# Altium schematic sheet VDB Linear Regulators.SchDoc
size A3
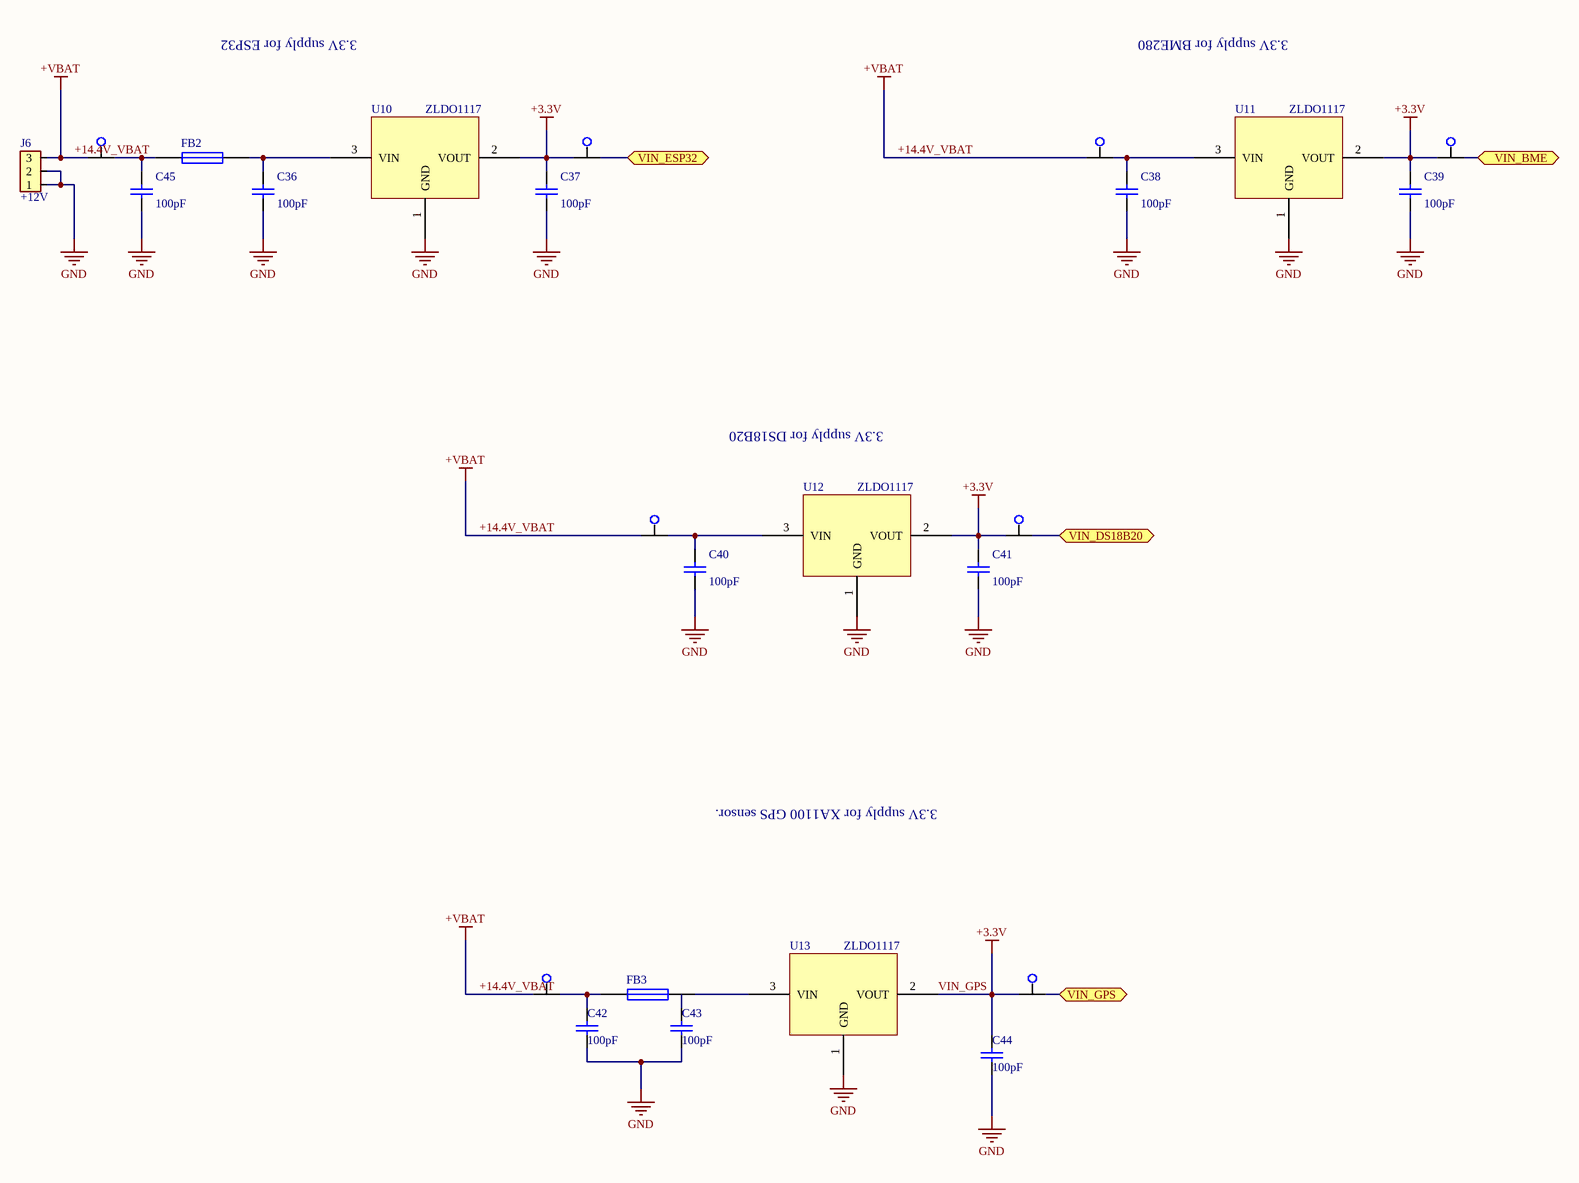
[diagram p0: VDB Linear Regulators.SchDoc]

## Parts
C36  value 100pF  [RAD-0.3]  (hidden comment: Cap)
C37  value 100pF  [RAD-0.3]  (hidden comment: Cap)
C38  value 100pF  [RAD-0.3]  (hidden comment: Cap)
C39  value 100pF  [RAD-0.3]  (hidden comment: Cap)
C40  value 100pF  [RAD-0.3]  (hidden comment: Cap)
C41  value 100pF  [RAD-0.3]  (hidden comment: Cap)
C42  value 100pF  [RAD-0.3]  (hidden comment: Cap)
C43  value 100pF  [RAD-0.3]  (hidden comment: Cap)
C44  value 100pF  [RAD-0.3]  (hidden comment: Cap)
C45  value 100pF  [RAD-0.3]  (hidden comment: Cap)
FB2  Fuse 1  [PIN-W2/E2.8]  (value not drawn)
FB3  Fuse 1  [PIN-W2/E2.8]  (value not drawn)
J6  +12V  [6410/3pin]
TP14  Hook Type Test Point  [36-500x-ND]  (value not drawn)
TP15  Hook Type Test Point  [36-500x-ND]  (value not drawn)
TP16  Hook Type Test Point  [36-500x-ND]  (value not drawn)
TP17  Hook Type Test Point  [36-500x-ND]  (value not drawn)
TP18  Hook Type Test Point  [36-500x-ND]  (value not drawn)
TP19  Hook Type Test Point  [36-500x-ND]  (value not drawn)
TP20  Hook Type Test Point  [36-500x-ND]  (value not drawn)
TP21  Hook Type Test Point  [36-500x-ND]  (value not drawn)
U10  ZLDO1117  [SOT230P700X165-4N]
U11  ZLDO1117  [SOT230P700X165-4N]
U12  ZLDO1117  [SOT230P700X165-4N]
U13  ZLDO1117  [SOT230P700X165-4N]

## Ports
VIN_BME, VIN_DS18B20, VIN_ESP32, VIN_GPS

## Nets
+14.4V_VBAT: J6.3 TP14.1 TP16.1 TP18.1 TP20.1  [also labelled +VBAT]
GND: C36.1 C37.2 C38.1 C39.2 C40.1 C41.2 C42.1 C43.1 C44.1 C45.1 J6.1 J6.2 U10.1(GND) U11.1(GND) U12.1(GND) U13.1(GND)
VIN_GPS: C37.1 C39.1 C41.1 C44.2 TP15.1 TP17.1 TP19.1 TP21.1 U10.2(VOUT) U11.2(VOUT) U12.2(VOUT) U13.2(VOUT)  [also labelled +3.3V]
VIN_BME: TP17.2 ; port VIN_BME
VIN_DS18B20: TP19.2 ; port VIN_DS18B20
VIN_ESP32: TP15.2 ; port VIN_ESP32
VIN_GPS: TP21.2 ; port VIN_GPS  [a separate net that carries the same name]
NetC36_2: C36.2 FB2.2 U10.3(VIN)
NetC38_2: C38.2 TP16.2 U11.3(VIN)
NetC40_2: C40.2 TP18.2 U12.3(VIN)
NetC42_2: C42.2 FB3.1 TP20.2
NetC45_2: C45.2 FB2.1 TP14.2
NetFB3_2: FB3.2 U13.3(VIN)

Not connected (* = marked no-connect by the designer): C43 2

## Notes on the sheet
- 3.3V supply for ESP32
- 3.3V supply for BME280
- 3.3V supply for DS18B20
- 3.3V supply for XA1100 GPS sensor.

## Library data of the parts
C36-C45 = Cap: Capacitor; Published: 8-Jun-2000; LatestRevisionDate: 17-Jul-2002; LatestRevisionNote: Re-released for DXP Platform.; PackageReference: RAD-0.3; Publisher: Altium Limited; PackageDescription: Radial Cap, Thru-Hole; 2 Leads; 0.3 in Pin Spacing
FB2 FB3 = Fuse 1: Fuse; Published: 8-Jun-2000; LatestRevisionDate: 17-Jul-2002; LatestRevisionNote: Re-released for DXP Platform.; PackageReference: PIN-W2/E2.8; Publisher: Altium Limited; PackageDescription: Thru-Hole; 2 Leads
J6 = CON3: Connector 3 pin; Value: *; Type: *; Mfg.: *; Supplier: *; Part#: *; Price: *; Notes: *
U10-U13 = ZLDO1117: Linear Regulator 1A